# Altium schematic sheet CW342_FPGA_CFG.SchDoc: <Enter Sheet Title>
size Letter; Organization: NewAE Technology Inc.; Address1: 1083 Queen St., Suite 196; Address2: Halifax; Address3: NS; Address4: Canada B3H 0B2; SheetNumber: 7; SheetTotal: 9; SheetApproved: NO
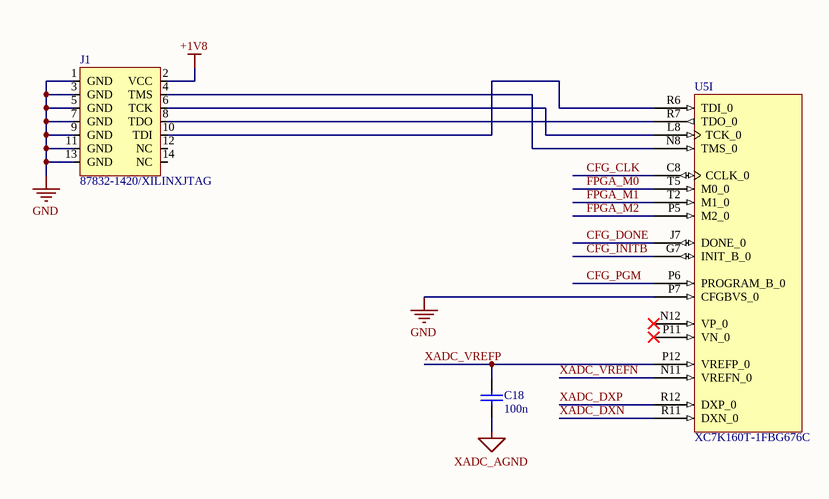
[diagram p0: CW342_FPGA_CFG.SchDoc]

## Parts
C18  100n  [CAPC0402_M]
J1  87832-1420/XILINXJTAG  [87832-1420]
U5  XC7K160T-1FBG676C  [FBG676]  (part I of 14)

## Nets
+1V8: J1.2(VCC)
GND: J1.1(GND) J1.3(GND) J1.5(GND) J1.7(GND) J1.9(GND) J1.11(GND) J1.13(GND) U5.P7(CFGBVS_0)
XADC_AGND: C18.2
CFG_CLK: U5.C8(CCLK_0)
CFG_DONE: U5.J7(DONE_0)
CFG_INITB: U5.G7(INIT_B_0)
CFG_PGM: U5.P6(PROGRAM_B_0)
FPGA_M0: U5.T5(M0_0)
FPGA_M1: U5.T2(M1_0)
FPGA_M2: U5.P5(M2_0)
XADC_DXN: U5.R11(DXN_0)
XADC_DXP: U5.R12(DXP_0)
XADC_VREFN: U5.N11(VREFN_0)
XADC_VREFP: C18.1 U5.P12(VREFP_0)
NetJ1_4: J1.4(TMS) U5.N8(TMS_0)
NetJ1_6: J1.6(TCK) U5.L8(TCK_0)
NetJ1_8: J1.8(TDO) U5.R7(TDO_0)
NetJ1_10: J1.10(TDI) U5.R6(TDI_0)

Not connected (* = marked no-connect by the designer): J1 12(NC) 14(NC); U5 N12(VP_0)* P11(VN_0)*

## Notes on the sheet
- Title:
- Date:
- Rev:
- Time:
- Project:
- Sheet
- of
- License:
- Copyright © NewAE Technology Inc.
- Approved:
- NewAE.com
- File:

## Library data of the parts
C18 = CCHIP-100n-0402: 100n, 0402; Manufacture Part Number 1: CGA2B3X7R1V104K050BB; Component Group: Capacitor; Case-EIA: 0402; Part Number: CCHIP-100n-0402; Footprint: 0402; Pin Count: 2; Value: 100n; Mounting Technology: SMT; Component Kind: Standard; Component Type: Standard; Supplier 1: Digi-Key; Supplier Part Number 1: 445-6901-1-ND
J1 = 87832-1420/XILINXJTAG: Molex 14-pin SMD, JTAG Pinout; Manufacture 1: Molex; Manufacture 1 Part Number: 87832-1420; Supplier 1: Digi-Key; Supplier Part Number 1: WM18641-ND
U5 = CMP-0361-00025-2: Kintex-7 FPGA, 400 User I/Os, 8 GTX, 676-Ball BGA, Speed Grade 1, Commercial Grade, Pb-Free; Manufacturer: Xilinx; SelectIO HR: 250; GTX: 8; SelectIO HP: 150; Speed Grade: -1; RoHS: Pb-Free; PackageReference: FBG676; Code_JEDEC: MS-034; Mounting Technology: Surface Mount; ComponentLink1URL: http://www.xilinx.com/support/documentation/data_sheets/ds180_7Series_Overview.pdf; DatasheetVersion: v1.12; Generic Part Number: XC7K160T; PartNumber: XC7K160T-1FBG676C; PackageVersion: Rev 1.8; ComponentLink2URL: http://www.xilinx.com/support/documentation/user_guides/ug475_7Series_Pkg_Pinout.pdf; PackageDescription: Flip-Chip Lidless BGA, Body 27 x 27 mm, 1.0 mm Pitch; ComponentLink1Description: Datasheet; ComponentLink2Description: Package Specification